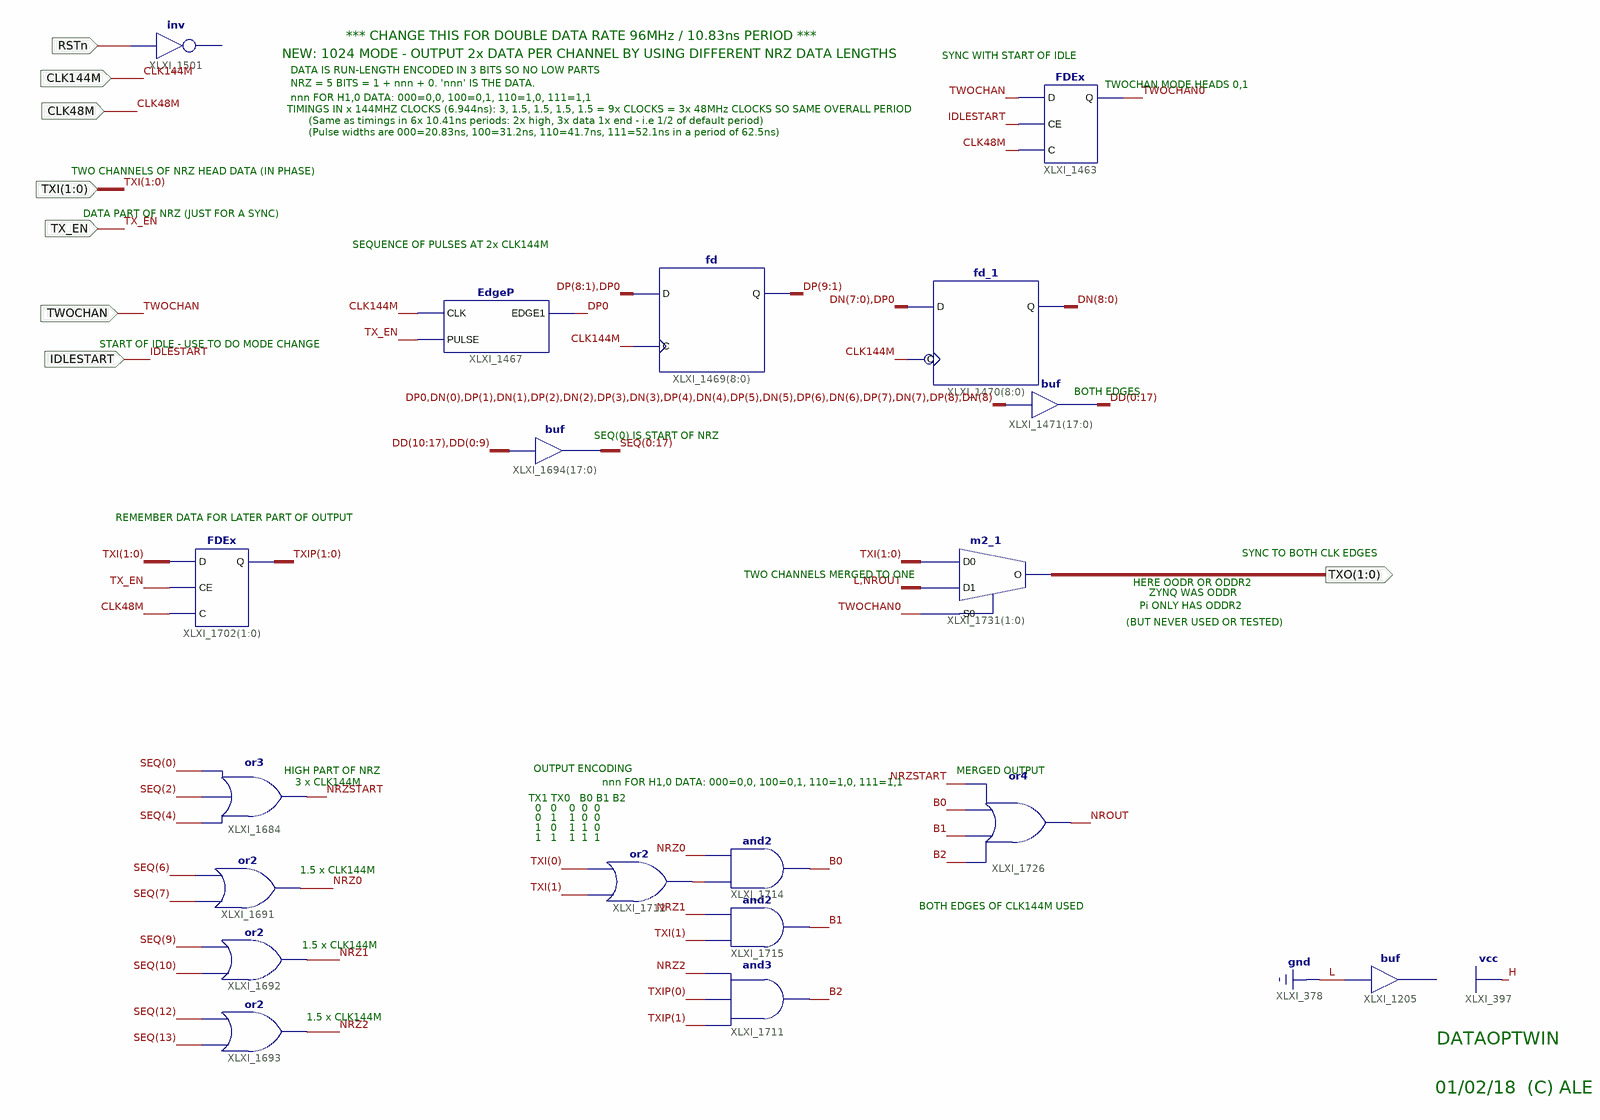
[diagram p0: schematic sheet 1]
// Xilinx ISE schematic DataOpTwin.sch (spartan3e) as structural Verilog: 19 symbols, 8 ports
module DataOpTwin (
  input  TWOCHAN,
  input  CLK48M,
  input  CLK144M,
  input  IDLESTART,
  input  TX_EN,
  input  [1:0] TXI,
  input  RSTn,
  output [1:0] TXO
);

  wire B0, B1, B2, DP0, NROUT, NRZ0, NRZ1, NRZ2, NRZSTART, TWOCHAN0, XLXN_141;
  wire [1:0] TXIP;
  wire [8:0] DN;
  wire [9:1] DP;
  wire [17:0] DD, SEQ;

  // buf XLXI_1205 has open pins: I=1'b0, O=open
  // inv XLXI_1501 has open pins: I=RSTn, O=open
  fd_1 XLXI_1470[8:0] (.C(CLK144M), .D({DN[7:0], DP0}), .Q(DN));
  fd XLXI_1469[8:0] (.C(CLK144M), .D({DP[8:1], DP0}), .Q(DP));
  EdgeP XLXI_1467 (.CLK(CLK144M), .EDGE1(DP0), .PULSE(TX_EN));
  assign {DD[0], DD[1], DD[2], DD[3], DD[4], DD[5], DD[6], DD[7], DD[8], DD[9], DD[10], DD[11], DD[12], DD[13], DD[14], DD[15], DD[16], DD[17]} = {DP0, DN[0], DP[1], DN[1], DP[2], DN[2], DP[3], DN[3], DP[4], DN[4], DP[5], DN[5], DP[6], DN[6], DP[7], DN[7], DP[8], DN[8]};  // buf XLXI_1471[17..0], 18 bits wide
  assign {SEQ[0], SEQ[1], SEQ[2], SEQ[3], SEQ[4], SEQ[5], SEQ[6], SEQ[7], SEQ[8], SEQ[9], SEQ[10], SEQ[11], SEQ[12], SEQ[13], SEQ[14], SEQ[15], SEQ[16], SEQ[17]} = {DD[10], DD[11], DD[12], DD[13], DD[14], DD[15], DD[16], DD[17], DD[0], DD[1], DD[2], DD[3], DD[4], DD[5], DD[6], DD[7], DD[8], DD[9]};  // buf XLXI_1694[17..0], 18 bits wide
  FDEx XLXI_1463 (.C(CLK48M), .CE(IDLESTART), .D(TWOCHAN), .Q(TWOCHAN0));
  FDEx XLXI_1702[1:0] (.C(CLK48M), .CE(TX_EN), .D(TXI), .Q(TXIP));
  or XLXI_1684 (NRZSTART, SEQ[4], SEQ[2], SEQ[0]);
  or XLXI_1691 (NRZ0, SEQ[7], SEQ[6]);
  or XLXI_1692 (NRZ1, SEQ[10], SEQ[9]);
  or XLXI_1693 (NRZ2, SEQ[13], SEQ[12]);
  or XLXI_1726 (NROUT, B2, B1, B0, NRZSTART);
  and XLXI_1711 (B2, TXIP[1], TXIP[0], NRZ2);
  and XLXI_1715 (B1, TXI[1], NRZ1);
  or XLXI_1712 (XLXN_141, TXI[1], TXI[0]);
  and XLXI_1714 (B0, XLXN_141, NRZ0);
  m2_1 XLXI_1731[1:0] (.D0(TXI), .D1({1'b0, NROUT}), .S0(TWOCHAN0), .O(TXO));

  // Notes on the sheet:
  //   *** CHANGE THIS FOR DOUBLE DATA RATE 96MHz / 10.83ns PERIOD ***
  //   NEW: 1024 MODE - OUTPUT 2x DATA PER CHANNEL BY USING DIFFERENT NRZ DATA LENGTHS
  //   SYNC WITH START OF IDLE
  //   DATA IS RUN-LENGTH ENCODED IN 3 BITS SO NO LOW PARTS
  //   NRZ = 5 BITS = 1 + nnn + 0. 'nnn' IS THE DATA.
  //   TWOCHAN MODE HEADS 0,1
  //   nnn FOR H1,0 DATA: 000=0,0, 100=0,1, 110=1,0, 111=1,1
  //   TIMINGS IN x 144MHZ CLOCKS (6.944ns): 3, 1.5, 1.5, 1.5, 1.5 = 9x CLOCKS = 3x 48MHz CLOCKS SO SAME OVERALL PERIOD
  //   (Same as timings in 6x 10.41ns periods: 2x high, 3x data 1x end - i.e 1/2 of default period)
  //   (Pulse widths are 000=20.83ns, 100=31.2ns, 110=41.7ns, 111=52.1ns in a period of 62.5ns)
  //   TWO CHANNELS OF NRZ HEAD DATA (IN PHASE)
  //   DATA PART OF NRZ (JUST FOR A SYNC)
  //   SEQUENCE OF PULSES AT 2x CLK144M
  //   START OF IDLE - USE TO DO MODE CHANGE
  //   BOTH EDGES
  //   SEQ(0) IS START OF NRZ
  //   REMEMBER DATA FOR LATER PART OF OUTPUT
  //   SYNC TO BOTH CLK EDGES
  //   TWO CHANNELS MERGED TO ONE
  //   HERE OODR OR ODDR2
  //   ZYNQ WAS ODDR
  //   Pi ONLY HAS ODDR2
  //   (BUT NEVER USED OR TESTED)
  //   OUTPUT ENCODING
  //   HIGH PART OF NRZ
  //   MERGED OUTPUT
  //   3 x CLK144M
  //   nnn FOR H1,0 DATA: 000=0,0, 100=0,1, 110=1,0, 111=1,1
  //   TX1 TX0   B0 B1 B2
  //   0   0    0  0  0
  //   0   1    1  0  0
  //   1   0    1  1  0
  //   1   1    1  1  1
  //   1.5 x CLK144M
  //   BOTH EDGES OF CLK144M USED
  //   1.5 x CLK144M
  //   1.5 x CLK144M
  //   DATAOPTWIN
  //   01/02/18  (C) ALE
endmodule
